# EAGLE design irRemoteLEDs (EAGLE 9.2.2)
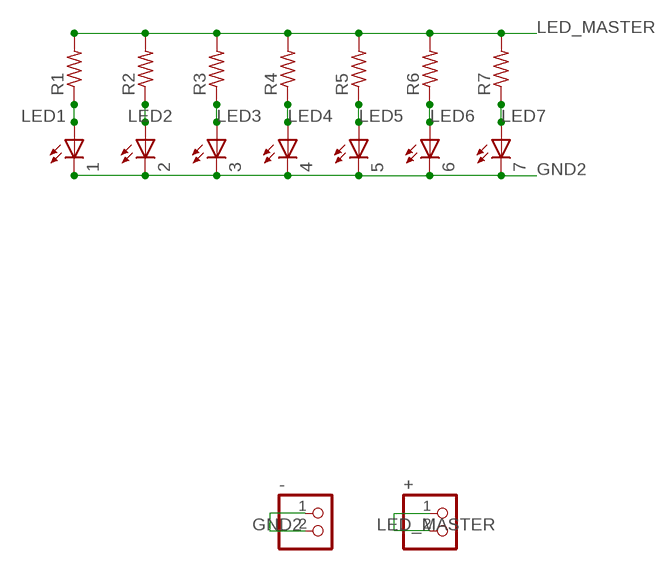
[diagram p0: schematic, sheet 1]

## Parts
1  LED5MM  [LED5MM]
2  LED5MM  [LED5MM]
3  LED5MM  [LED5MM]
4  LED5MM  [LED5MM]
5  LED5MM  [LED5MM]
6  LED5MM  [LED5MM]
7  LED5MM  [LED5MM]
+  PINHD-1X2  [1X02]
-  PINHD-1X2  [1X02]
R1  R-US_M0805  [M0805]
R2  R-US_M0805  [M0805]
R3  R-US_M0805  [M0805]
R4  R-US_M0805  [M0805]
R5  R-US_M0805  [M0805]
R6  R-US_M0805  [M0805]
R7  R-US_M0805  [M0805]

## Nets
GND2: 1.K(C) 2.K(C) 3.K(C) 4.K(C) 5.K(C) 6.K(C) 7.K(C) -.1 -.2
LED1: 1.A R1.1
LED2: 2.A R2.1
LED3: 3.A R3.1
LED4: 4.A R4.1
LED5: 5.A R5.1
LED6: 6.A R6.1
LED7: 7.A R7.1
LED_MASTER: +.1 +.2 R1.2 R2.2 R3.2 R4.2 R5.2 R6.2 R7.2

## Library data of the parts
1-7 = led:LED: LED OSRAM: - CHIPLED LG R971, LG N971, LY N971, LG Q971, LY Q971, LO R971, LY R971 LH N974, LH R974 LS Q976, LO Q976, LY Q976 LO Q996 - Hyper CHIPLED LW Q18S LB Q993, LB Q99A, LB R99A - SideLED LS A670, LO A670, LY A670, LG A670, LP A670 LB A673, LV A673, LT A673, LW A673 LH A674 LY A675 LS A676, LA A676, LO A676, LY A676, LW A676 LS A679, LY A679, LG A679 - Hyper Micro SIDELED® LS Y876, LA Y876, LO Y876, LY Y876 LT Y87S - SmartLED LW L88C, LW L88S LB L89C, LB L89S, LG L890 LS L89K, LO L89K, LY L89K LS L896, LA L896, LO L896, LY L896 - TOPLED LS T670, LO T670, LY T670, LG T670, LP T670 LSG T670, LSP T670, LSY T670, LOP T670, LYG T670 LG T671, LOG T671, LSG T671 LB T673, LV T673, LT T673, LW T673 LH T674 LS T676, LA T676, LO T676, LY T676, LB T676, LH T676, LSB T676, LW T676 LB T67C, LV T67C, LT T67C, LS T67K, LO T67K, LY T67K, LW E67C LS E67B, LA E67B, LO E67B, LY E67B, LB E67C, LV E67C, LT E67C LW T67C LS T679, LY T679, LG T679 LS T770, LO T770, LY T770, LG T770, LP T770 LB T773, LV T773, LT T773, LW T773 LH T774 LS E675, LA E675, LY E675, LS T675 LS T776, LA T776, LO T776, LY T776, LB T776 LHGB T686 LT T68C, LB T68C - Hyper Mini TOPLED® LB M676 - Mini TOPLED Santana® LG M470 LS M47K, LO M47K, LY M47K Source: http://www.osram.convergy.de LUXEON: - LUMILED® LXK2-PW12-R00, LXK2-PW12-S00, LXK2-PW14-U00, LXK2-PW14-V00 LXK2-PM12-R00, LXK2-PM12-S00, LXK2-PM14-U00 LXK2-PE12-Q00, LXK2-PE12-R00, LXK2-PE12-S00, LXK2-PE14-T00, LXK2-PE14-U00 LXK2-PB12-K00, LXK2-PB12-L00, LXK2-PB12-M00, LXK2-PB14-N00, LXK2-PB14-P00, LXK2-PB14-Q00 LXK2-PR12-L00, LXK2-PR12-M00, LXK2-PR14-Q00, LXK2-PR14-R00 LXK2-PD12-Q00, LXK2-PD12-R00, LXK2-PD12-S00 LXK2-PH12-R00, LXK2-PH12-S00 LXK2-PL12-P00, LXK2-PL12-Q00, LXK2-PL12-R00 Source: www.luxeon.com KINGBRIGHT: KA-3528ASYC Source: www.kingbright.com
+ - = pinhead:PINHD-1X2: PIN HEADER
R1-R7 = adafruit:R-US_: RESISTOR, American symbol

## Board
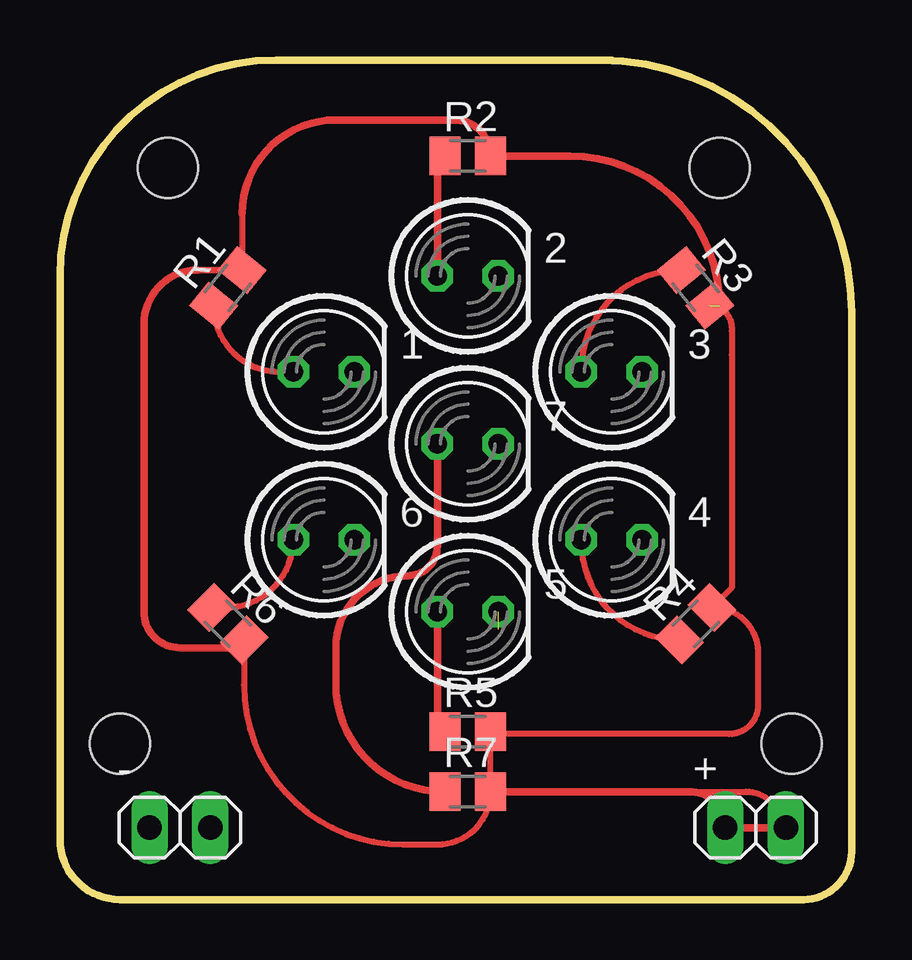
[diagram p1: board, top side]
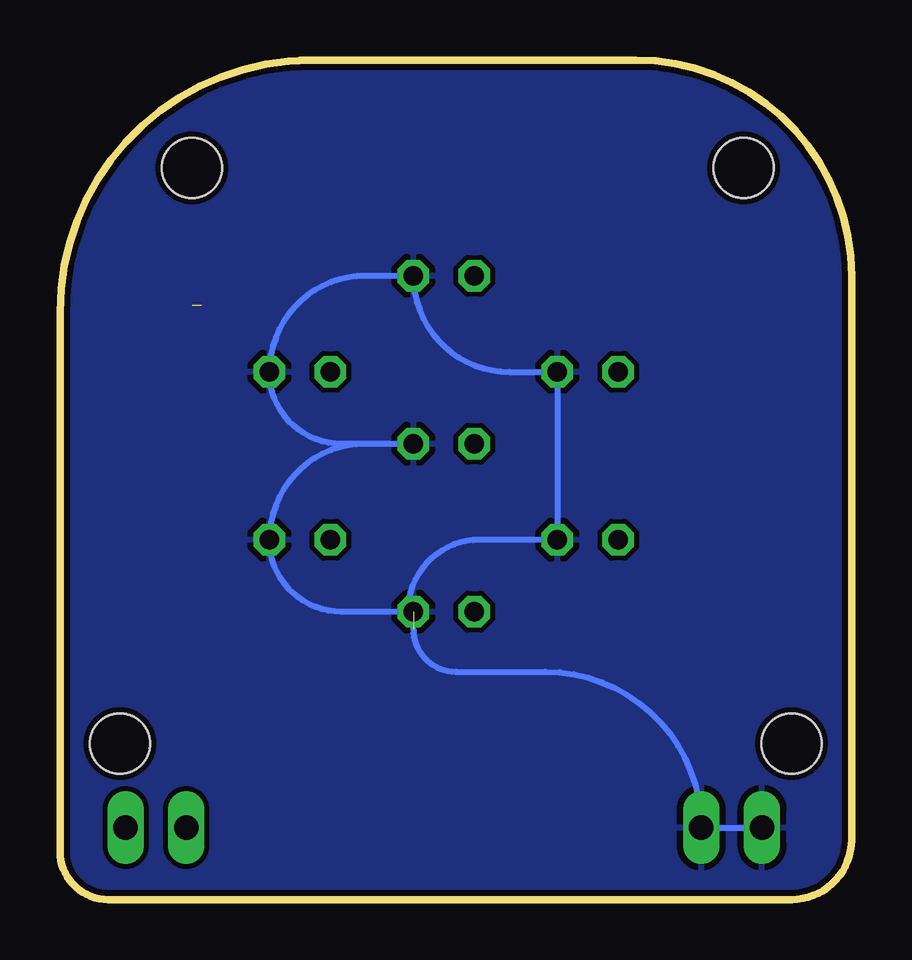
[diagram p2: board, bottom side, seen from below]

Size 33 x 35 mm. Coordinates in mm from the lower left corner, seen from the top.
Outline: 31,0 arc90 33,2
Outline: 33,24.5 arc90 22.5,35
Outline: 9,35 arc90 0,26
Outline: 0,2.5 arc90 2.5,0
Outline: 23,35 22.5,35
Outline: 22.5,35 9,35
Outline: 9,35 arc90 0,26
Outline: 0,26 0,2.5
Outline: 0,2.5 arc90 2.5,0
Outline: 2.5,0 31,0
Outline: 31,0 arc90 33,2
Outline: 33,2 33,24.5
Outline: 33,24.5 arc90 22.5,35
Copper layers (1*16): Top 0.035mm / dielectric 1.5mm / Bottom 0.035mm
Design rules "adafruit *": minimum track width 8mil, minimum drill 15.5mil, track to track 8mil, track to pad 8mil, pad to pad 8mil, via to via 8mil, smd to smd 8mil, copper to edge 10mil, drill to drill 8mil, minimum pad ring 10mil, minimum via ring 8mil, stop-mask expansion 2mil, vias tented up to drill 20mil, thermal gap 10mil
Holes 2.5 mm at 4.5,30.5 27.5,30.5 2.5,6.5 30.5,6.5

### Footprints (pad centres in the part's own frame; a part is rotated, then mirrored left to right if it is on the bottom)
LED5MM = drill 0.813 octagon: A -1.27,0; K 1.27,0
1X02 = drill 1.016 long: 1 -1.27,0; 2 1.27,0
M0805 = smd 1.3 x 1.6: 1 -0.95,0; 2 0.95,0

### Placement (x,y rotation side)
1  11,22 0 top
2  17,26 0 top
3  23,22 0 top
4  23,15 0 top
5  17,12 0 top
6  11,15 0 top
7  17,19 0 top
+  29,3 0 top
-  5,3 0 top
R1  7,25.5 51.3 top
R2  17,31 0 top
R3  26.5,25.5 308.7 top
R4  26.5,11.5 45 top
R5  17,7 0 top
R6  7,11.5 315 top
R7  17,4.5 0 top

### Tracks (layer width: path | path; a pad name or v marks a point on that pad's centre or on a via)
GND2  (1 unrouted)
  Bottom 0.254: 5.K 18.5,12 | 18.5,12 21.27,12 arc90 4.K arc90 20.27,19 7.K 21.27,19 arc90 3.K arc90 20.27,26 2.K arc-90 14.27,22 1.K 6.K 15.5,15 arc-90 18.5,12 | 18.27,11.27 arc-90 16.5,9.5 12.77,9.5 arc90 -.2 -.1
  pour Bottom: -5.9,37.7 -5.9,-1.7 36.5,-1.7 36.5,37.7
LED1
  Top 0.254: R1.1 arc90 9.17,22 1.A
LED2
  Top 0.305: 2.A 15.73,30.68 arc-90 R2.1
LED3
  Top 0.254: R3.1 arc90 21.73,22.07 3.A
LED4
  Top 0.254: 4.A 21.73,14.93 arc90 R4.1
LED5
  Top 0.305: 5.A 15.73,7.32 arc90 R5.1
LED6
  Top 0.254: R6.1 6.9,12.17 arc90 6.A
LED7
  Top 0.305: R7.1 16,4.5 arc-90 11.5,9 11.5,10.5 arc-90 14.5,13.5 arc90 15.73,14.73 7.A
LED_MASTER  (1 unrouted)
  Top 0.254: 7.59,26.34 arc-90 7.5,26.24 | 7.59,28.59 7.59,26.34 | 7.59,26.34 arc-90 7.5,26.24 | 5.74,26.24 7.5,26.24 | R6.2 7.67,8.93 arc90 14.3,2.3 15.75,2.3 arc90 R7.2 | R1.2 5.74,26.24 | 5.74,26.24 arc90 3.5,24 | R7.2 R5.2 17.95,6.9 27.9,6.9 arc90 29.1,8.1 29.1,10.3 arc90 27.23,12.17 R4.2 28,13 28,22.7 28,23.7 28,23.85 arc90 R3.2 | R7.2 19.9,4.5 | R7.2 28.6,4.5 arc-90 30.1,3
  Top 0.305: 27.74,24.76 27.5,24.76 arc90 21.26,31 R2.2 arc90 16.45,32.5 11.5,32.5 arc90 7.59,28.59 | 5.74,26.24 arc90 3.5,24 3.5,12 arc90 5,10.5 7.34,10.5 | +.2 30.1,3 +.1 arc90 26.23,4.5 18,4.5

### Text on the board
tDocu: D0/A4/SDA | D4/A2/RXD/MOSI | D1/A0/VOUT | D3/A3/TXD/SCK | D2/A1/SCL/MISO